# Altium project MPPT_charger.PrjPcb
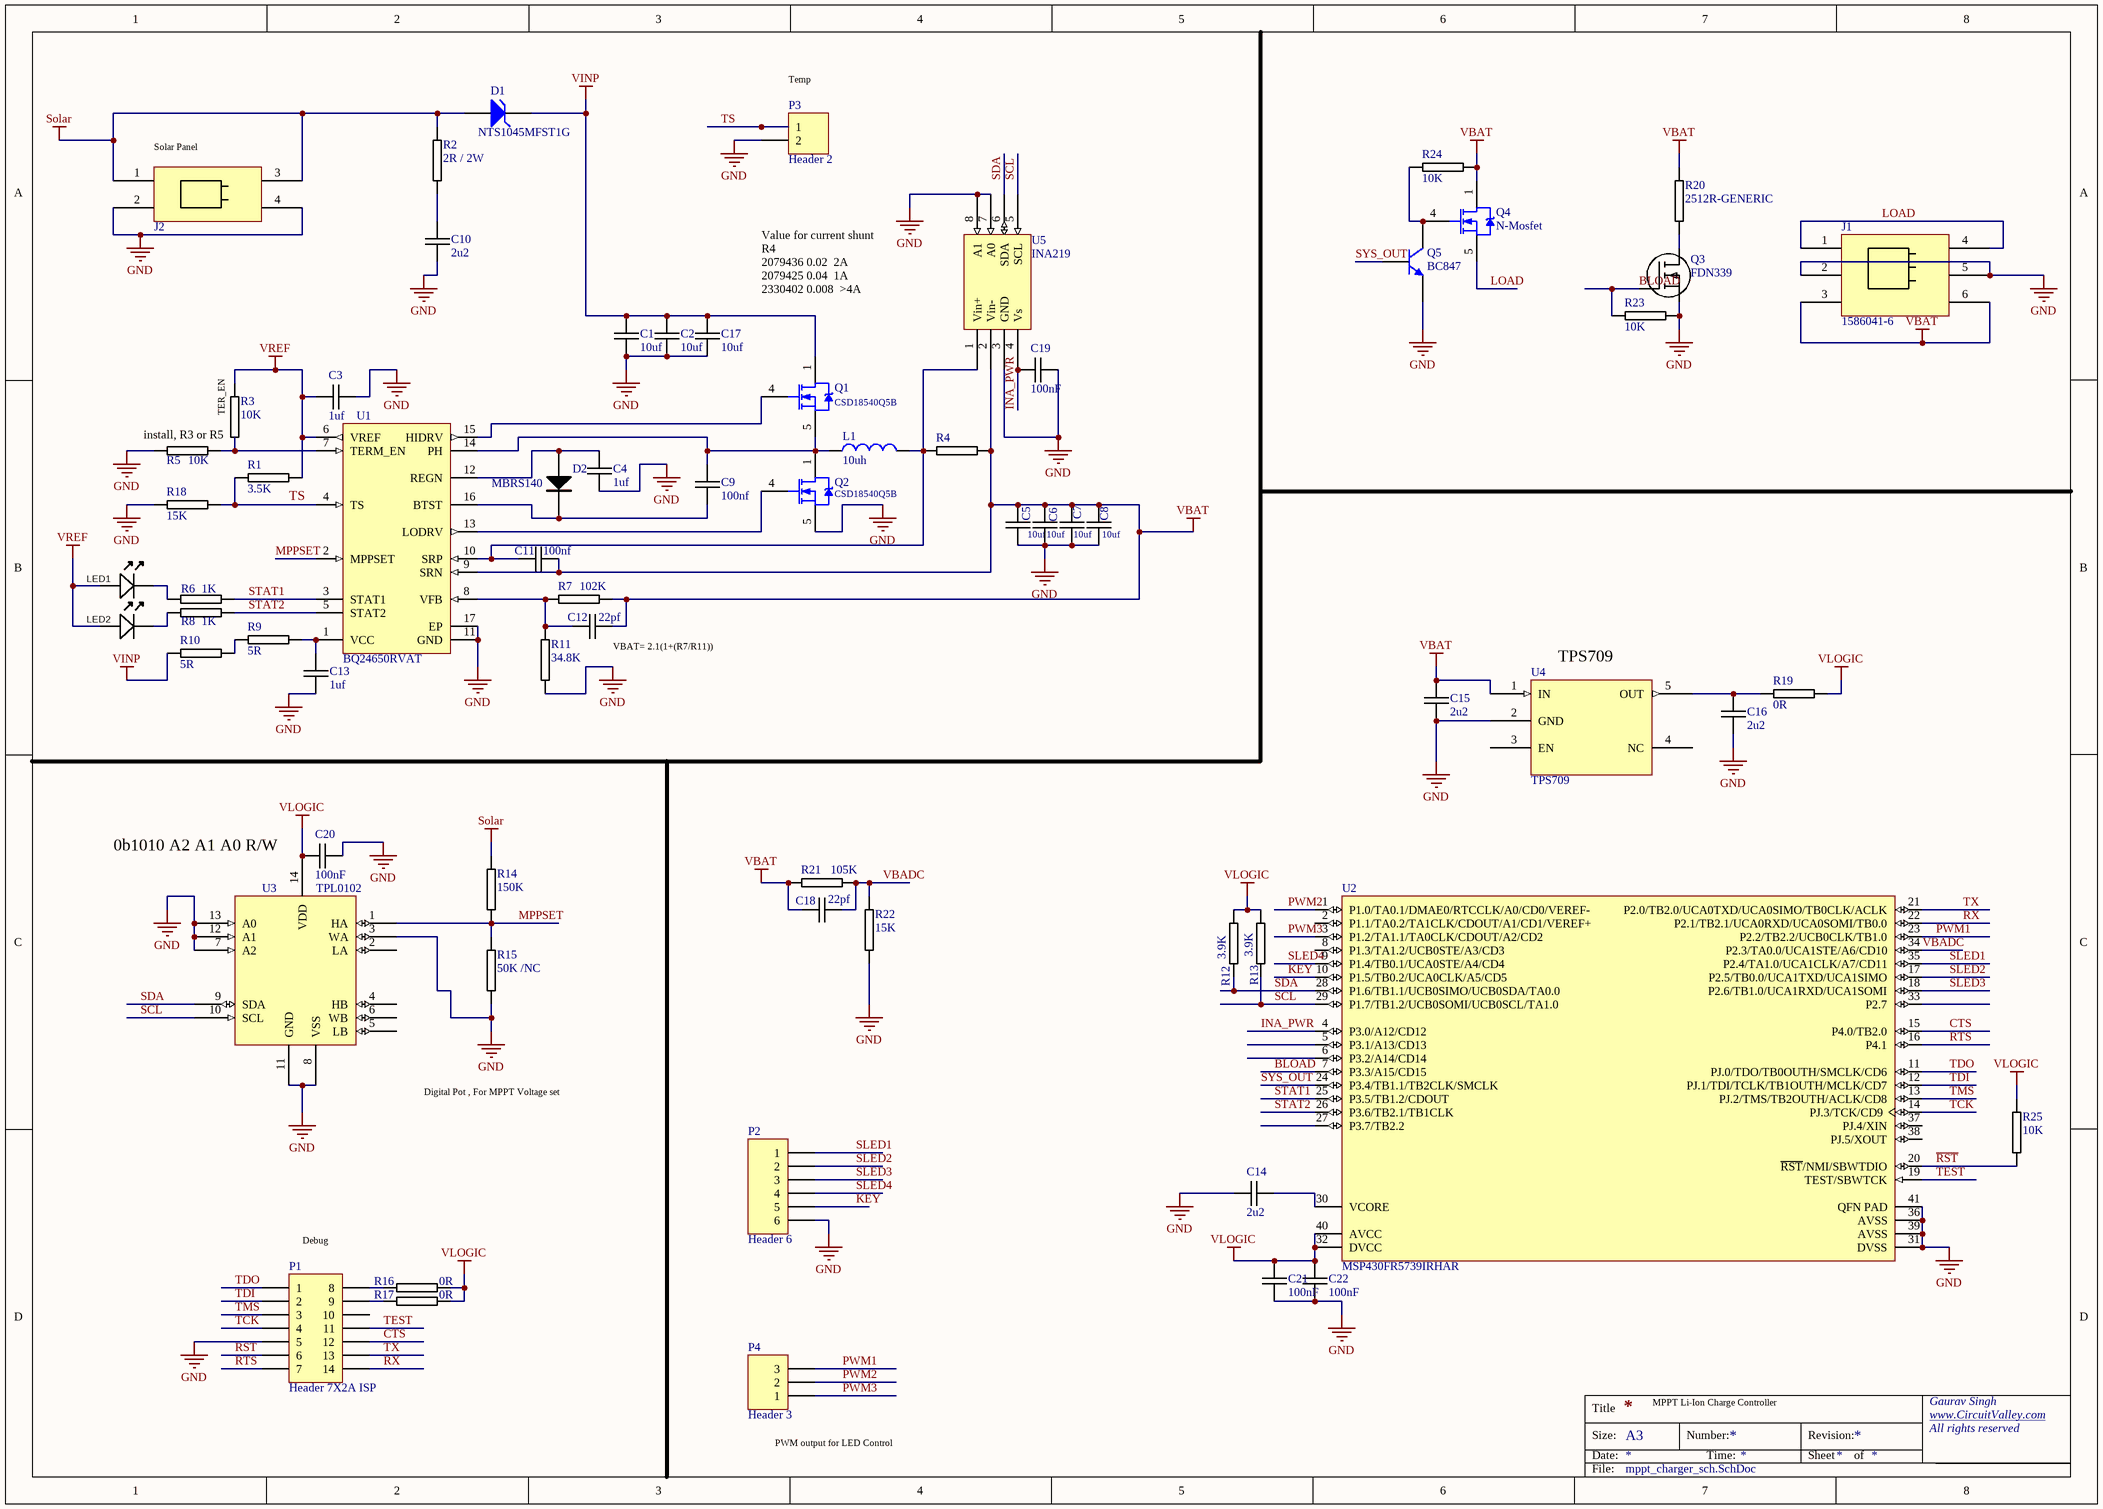
[diagram p0: mppt_charger_sch.SchDoc]
1 sheet, 68 parts. Net scope: global (net labels, ports and power ports of the same name join across sheets).
Board file: MPPT_charger.PcbDoc

## Sheet mppt_charger_sch.SchDoc
size A3

### Parts
C1  10uf  [1210C-GENERIC]
C2  10uf  [1210C-GENERIC]
C3  1uf  [0805C-GENERIC]
C4  1uf  [0805C-GENERIC]
C5  10uf  [1210C-GENERIC]
C6  10uf  [1210C-GENERIC]
C7  10uf  [1210C-GENERIC]
C8  10uf  [1210C-GENERIC]
C9  100nf  [0805C-GENERIC]
C10  2u2  [1210C-GENERIC]
C11  100nf  [0805C-GENERIC]
C12  22pf  [0805C-GENERIC]
C13  1uf  [0805C-TBD]
C14  2u2  [0805C-GENERIC]
C15  2u2  [1210C-GENERIC]
C16  2u2  [1210C-GENERIC]
C17  10uf  [1210C-GENERIC]
C18  22pf  [0805C-GENERIC]
C19  100nF  [0603C-GENERIC]
C20  100nF  [0603C-GENERIC]
C21  100nF  [0603C-GENERIC]
C22  100nF  [0603C-GENERIC]
D1  NTS1045MFST1G  [DFN5_5x6]
D2  MBRS140  [DIODE-SMA]
J1  1586041-6  [1586043-6]
J2  1586041-4  [1586043-4]  (value not drawn)
L1  10uh  [SRP1238A]
LED1  (no value)  [LED-0805-K]
LED2  (no value)  [LED-0805-K]
P1  Header 7X2A ISP  [HDR2X7_CEN]
P2  Header 6  [5267-06A]
P3  Header 2  [5267-02A]
P4  Header 3  [5267-03A]
Q1  CSD18540Q5B  [SON8]
Q2  CSD18540Q5B  [SON8]
Q3  FDN339  [SOT23-GDS]
Q4  N-Mosfet  [SON8]
Q5  BC847  [SOT23_N]
R1  3.5K  [0805R-2K2]
R2  2R / 2W  [2512R-GENERIC]
R3  10K  [0805R-2K2]
R4  (no value)  [2512R-GENERIC]
R5  10K  [0805R-2K2]
R6  1K  [0805R-2K2]
R7  102K  [0805R-2K2]
R8  1K  [0805R-2K2]
R9  5R  [0805R-2K2]
R10  5R  [0805R-2K2]
R11  34.8K  [0805R-2K2]
R12  3.9K  [0805R-2K2]
R13  3.9K  [0805R-2K2]
R14  150K  [0805R-2K2]
R15  50K /NC  [0805R-2K2]
R16  0R  [0805R-2K2]
R17  0R  [0805R-2K2]
R18  15K  [0805R-2K2]
R19  0R  [0805R-2K2]
R20  2512R-GENERIC  [2512R-GENERIC]
R21  105K  [0805R-2K2]
R22  15K  [0805R-2K2]
R23  10K  [0603R-10K]
R24  10K  [0603R-10K]
R25  10K  [0603R-10K]
U1  BQ24650RVAT  [QFN16]
U2  MSP430FR5739IRHAR  [QFN40]
U3  TPL0102  [XQFN14_2mmx2mm]
U4  TPS709  [SOT23-5]
U5  INA219  [SOT23-8]

### Nets
GND: C1.2 C2.2 C3.2 C4.2 C5.2 C6.2 C7.2 C8.2 C10.2 C13.2 C14.1 C15.2 C16.2 C17.2 C19.1 C20.2 C21.2 C22.2 J1.2(IN) J1.5 J2.2(IN) J2.4(IN) P1.5 P2.6 P3.2 Q2.5(S) Q3.S Q5.2(E) R5.1 R11.1 R15.1 R18.2 R22.1 R23.1 U1.11(GND) U1.17(EP) U2.31(DVSS) U2.36(AVSS) U2.39(AVSS) U2.41(QFN_PAD) U3.3(WA) U3.7(A2) U3.8(VSS) U3.11(GND) U3.12(A1) U3.13(A0) U4.2(GND) U5.3(GND) U5.7(A0) U5.8(A1)
Solar: D1.1(A) J2.1(IN) J2.3(IN) R2.2 R14.2
VBAT: C5.1 C6.1 C7.1 C8.1 C11.2 C12.2 C15.1 C18.2 J1.3(IN) J1.6 Q4.1(D) R4.2 R7.1 R20.2 R21.1 R24.1 U1.9(SRN) U4.1(IN) U5.2(Vin-)
VINP: C1.1 C2.1 C17.1 D1.2(K) Q1.1(D) R10.1
VLOGIC: C20.1 C21.1 C22.1 R12.2 R13.2 R16.1 R17.1 R19.1 R25.1 U2.32(DVCC) U2.40(AVCC) U3.14(VDD)
VREF: C3.1 LED1.A LED2.A R1.1 R3.2 U1.6(VREF)
BLOAD: Q3.G R23.2 U2.7(P3.3/A15/CD15)
CTS: P1.12 U2.15(P4.0/TB2.0)
INA_PWR: C19.2 U2.4(P3.0/A12/CD12) U5.4(Vs)
KEY: P2.5 U2.10(P1.5/TB0.2/UCA0CLK/A5/CD5)
LOAD: J1.1(IN) J1.4(IN) Q4.5(S)
MPPSET: R14.1 R15.2 U1.2(MPPSET) U3.1(HA)
PWM1: P4.3 U2.23(P2.2/TB2.2/UCB0CLK/TB1.0)
PWM2: P4.2 U2.1(P1.0/TA0.1/DMAE0/RTCCLK/A0/CD0/VEREF-)
PWM3: P4.1 U2.3(P1.2/TA1.1/TA0CLK/CDOUT/A2/CD2)
~{RST}: P1.6 R25.2 U2.20(~{RST}/NMI/SBWTDIO)
RTS: P1.7 U2.16(P4.1)
RX: P1.14 U2.22(P2.1/TB2.1/UCA0RXD/UCA0SOMI/TB0.0)
SCL: R13.1 U2.29(P1.7/TB1.2/UCB0SOMI/UCB0SCL/TA1.0) U3.10(SCL) U5.5(SCL)
SDA: R12.1 U2.28(P1.6/TB1.1/UCB0SIMO/UCB0SDA/TA0.0) U3.9(SDA) U5.6(SDA)
SLED1: P2.1 U2.35(P2.4/TA1.0/UCA1CLK/A7/CD11)
SLED2: P2.2 U2.17(P2.5/TB0.0/UCA1TXD/UCA1SIMO)
SLED3: P2.3 U2.18(P2.6/TB1.0/UCA1RXD/UCA1SOMI)
SLED4: P2.4 U2.9(P1.4/TB0.1/UCA0STE/A4/CD4)
STAT1: R6.2 U1.3(STAT1) U2.25(P3.5/TB1.2/CDOUT)
STAT2: R8.2 U1.5(STAT2) U2.26(P3.6/TB2.1/TB1CLK)
SYS_OUT: Q5.1(B) U2.24(P3.4/TB1.1/TB2CLK/SMCLK)
TCK: P1.4 U2.14(PJ.3/TCK/CD9)
TDI: P1.2 U2.12(PJ.1/TDI/TCLK/TB1OUTH/MCLK/CD7)
TDO: P1.1 U2.11(PJ.0/TDO/TB0OUTH/SMCLK/CD6)
TEST: P1.11 U2.19(TEST/SBWTCK)
TMS: P1.3 U2.13(PJ.2/TMS/TB2OUTH/ACLK/CD8)
TS: P3.1 R1.2 R18.1 U1.4(TS)
TX: P1.13 U2.21(P2.0/TB2.0/UCA0TXD/UCA0SIMO/TB0CLK/ACLK)
VBADC: C18.1 R21.2 R22.2 U2.34(P2.3/TA0.0/UCA1STE/A6/CD10)
NetC4_1: C4.1 D2.A U1.12(REGN)
NetC9_1: C9.1 L1.1 Q1.5(S) Q2.1(D) U1.14(PH)
NetC9_2: C9.2 D2.K U1.16(BTST)
NetC10_1: C10.1 R2.1
NetC11_1: C11.1 L1.2 R4.1 U1.10(SRP) U5.1(Vin+)
NetC12_1: C12.1 R7.2 R11.2 U1.8(VFB)
NetC13_1: C13.1 R9.2 U1.1(VCC)
NetC14_2: C14.2 U2.30(VCORE)
NetC16_1: C16.1 R19.2 U4.5(OUT)
NetLED1_K: LED1.K R6.1
NetLED2_K: LED2.K R8.1
NetP1_8: P1.8 R16.2
NetP1_9: P1.9 R17.2
NetQ1_4: Q1.4(G) U1.15(HIDRV)
NetQ2_4: Q2.4(G) U1.13(LODRV)
NetQ3_D: Q3.D R20.1
NetQ4_4: Q4.4(G) Q5.3(C) R24.2
NetR3_1: R3.1 R5.2 U1.7(TERM_EN)
NetR9_1: R9.1 R10.2

Not connected (* = marked no-connect by the designer): P1 10; U2 2(P1.1/TA0.2/TA1CLK/CDOUT/A1/CD1/VEREF+) 5(P3.1/A13/CD13) 6(P3.2/A14/CD14) 8(P1.3/TA1.2/UCB0STE/A3/CD3) 27(P3.7/TB2.2) 33(P2.7) 37(PJ.4/XIN) 38(PJ.5/XOUT); U3 2(LA) 4(HB) 5(LB) 6(WB); U4 3(EN) 4(NC)

### Notes on the sheet
- (near P3) Temp
- (near J2) Solar Panel
- Value for current shunt R4
  2079436 0.02  2A
  2079425 0.04  1A
  2330402 0.008  >4A
- (near R3) install, R3 or R5
- (near R3) TER_EN
- (near C12) VBAT= 2.1(1+(R7/R11))
- (near U4) TPS709
- 0b1010 A2 A1 A0 R/W
- Digital Pot , For MPPT Voltage set
- (near P1) Debug
- (near P4) PWM output for LED Control
- MPPT Li-Ion Charge Controller
- Title
- Size:
- Date:
- A3
- Number:
- Time:
- Revision:
- Sheet
- of
- Gaurav Singh
- www.CircuitValley.com
- All rights reserved
- File:

### Library data of the parts
C1 C2 C5-C8 C10 C15-C17 = 1210C-2u2-35V: GENERIC CAPACITOR NON POLARISED 1210; Manufacturer: Panasonic - ECG; Manufacturer Part Number: ECJ-4YB0J226M; Reel: C25; Supplier 1: Digi-Key; Supplier Part Number 1: 587-2255-2-ND
C3 C4 C9 C11 C12 C14 C18 = 0805C-2U2-6V3-X5R-PAN: CAPACITOR 0805 CERAMIC; Manufacturer Part Number: ECJ-1VB0J225K; Manufacturer: Panasonic - ECG; Reel: C7; Supplier 1: Digi-Key; Supplier Part Number 1: PCC2273TR-ND
C13 = 0805C-TBD: CAPACITOR 0805 CERAMIC VALUE TO BE DETERMINED
C19-C22 = 0603C-100NF-25V-X7R-TDK: CAPACITOR 0603 CERAMIC; Manufacturer Part Number: C1608X7R1E104K; Manufacturer: TDK Corporation; Reel: C12; Supplier 1: Digi-Key; Supplier Part Number 1: 445-1316-2-ND
D1 = SK3200: ELEMENT14 Order code: 2452050
D2 = MBRS140: DIODE; Supplier 1: Digi-Key; Supplier Part Number 1: MBRS140FSTR-ND
L1 = inductor_smd: ELEMENT14 Order code: 2434037
LED1 LED2 = LED_SMD_Green_0805: LED, 0805 SMD, Green; Manufacturer 1: Ligitek; Manufacturer Part Number 1: LG170G-CT; Material: GaP; Ratings: 10 mcd; 573 nm; Package / Case: 0805
P1 = Header 7X2A: Header, 7-Pin, Dual row; LatestRevisionDate: 17-Jul-2002; LatestRevisionNote: Re-released for DXP Platform.; Publisher: Altium Limited
P2 = Header 6: Header, 6-Pin; LatestRevisionDate: 17-Jul-2002; LatestRevisionNote: Re-released for DXP Platform.; Publisher: Altium Limited
P3 = Header 2: Header, 2-Pin; LatestRevisionDate: 17-Jul-2002; LatestRevisionNote: Re-released for DXP Platform.; Publisher: Altium Limited
P4 = Header 3: Header, 3-Pin; LatestRevisionDate: 17-Jul-2002; LatestRevisionNote: Re-released for DXP Platform.; Publisher: Altium Limited
Q1 Q2 = N-Mosfet
Q3 = FDN339: N-MOS TRANSISTOR FDN339; Manufacturer: Fairchild Semiconductor; Manufacturer Part Number: FDN339AN; Power - Max: 460mW; Rds On (Max) @ Id, Vgs: 35 mOhm @ 3A, 4.5V; FET Type: MOSFET N-Channel, Metal Oxide; Vgs(th) (Max) @ Id: 1.5V @ 250µA; FET Feature: Logic Level Gate; Input Capacitance (Ciss) @ Vds: 700pF @ 10V; Current - Continuous Drain (Id) @ 25° C: 3A; Drain to Source Voltage (Vdss): 20V; Gate Charge (Qg) @ Vgs: 10nC @ 4.5V; Reel: Q4; Supplier 1: Digi-Key; Supplier Part Number 1: FDN339ANTR-ND; Mounting Type: Surface Mount; RoHS: RoHS Compliant; Packaging: Tape & Reel (TR); Supplier: Digi-Key; Supplier Part Number: FDN339ANTR-ND; Package / Case: 3-SSOT, SuperSOT-3; Category: Discrete Semiconductor Products
Q5 = BC847: NPN General-purpose Transistor; Published: 17-Sep-2003; LatestRevisionDate: 12-Dec-2006; LatestRevisionNote: IPC-7351 Footprint Added.; DatasheetVersion: 4-Feb-2002; PackageVersion: May-1999; PackageReference: SOT23; Publisher: Altium Limited; PackageDescription: 3-Pin SOT-23 Package 0.95 mm Pitch, 2.3 mm Lead Span; ComponentLink1Description: Manufacturer Link; ComponentLink1URL: http://www.semiconductors.philips.com/; ComponentLink2Description: Datasheet; ComponentLink2URL: http://www.semiconductors.philips.com/acrobat/datasheets/BC846_BC847_BC848_5.pdf
R1 R3 R5-R19 R21 R22 = 0805R-2K2: RESISTOR 0805 1/4 WATT THIN FILM; Reel: *
R2 R4 R20 = 2512R-GENERIC: GENERIC RESISTOR 2512; Reel: *
  R2: ELEMENT14 Order code: 2328162
R23-R25 = 0603R-10K: GENERIC RESISTOR 0603; Manufacturer: Stackpole Electronics Inc; Manufacturer Part Number: RMCF 1/16 10K 1% R; Tolerance: ±1%; Power (Watts): 0.1W, 1/10W; Temperature Coefficient: ±100ppm/°C; Resistance In Ohms: 10.0K; Reel: R21; Category: Resistors; Supplier Part Number: RMCF1/1610KFRDKR-ND; Lead Style: Surface Mount (SMD - SMT); RoHS: RoHS Compliant; Packaging: Digi-Reel®; Case: 0603 (1608 metric); Composition: Thick Film; Supplier: Digi-Key; Supplier 1: Digi-Key; Supplier Part Number 1: RMCF0603FT10K0DKR-ND
U1 = BQ24650RVAT: High Efficiency Synchronous Switch-Mode Charger Controller- Solar Battery Charger, 5 V, -40 to 85 degC, 16-pin VQFN (RVA), Green (RoHS & no Sb/Br); Manufacturer: Texas Instruments; Lead Acid: N; SubFamily: Battery Charge Management; Vin(Min)(V): 5; DatasheetVersion: SLUSA75; PackageVersion: revC, May-2011; PackageReference: RVA16-2140X2140TP; PackageDescription: 16-Pin Plastic Quad Flatpack No-Lead, 3.5 x 3.5 mm Body, 0.5 mm Pitch, Exposed Pad; Supplier 1: Digi-Key; Supplier Part Number 1: 296-27699-2-ND; Supplier 2: Digi-Key; Supplier Part Number 2: 296-27699-1-ND; Supplier 3: Digi-Key; Supplier Part Number 3: 296-27699-6-ND; Supplier 4: Farnell; Supplier Part Number 4: 1882266RL; Supplier 5: Farnell; Supplier Part Number 5: 1882266; Supplier 6: Farnell; Supplier Part Number 6: 2125812; Supplier 7: Newark; Supplier Part Number 7: 83R9416; Supplier 8: Mouser; Supplier Part Number 8: 595-BQ24650RVAT; Eco-Plan: Green (RoHS & no Sb/Br); Li-Ion: N; Li-Polymer: N; NiCd: N; NiMH: N; Over Voltage Protection: N; Mounting Technology: Surface Mount; PartNumber: BQ24650RVAT; ComponentLink1Description: Datasheet; ComponentLink1URL: http://www.ti.com/general/docs/lit/getliterature.tsp?genericPartNumber=BQ24650&fileType=pdf
U2 = MSP430FR5739IRHAR: 24 MHz Mixed Signal Microcontroller, 1024 B SRAM and 33 GPIOs, -40 to 85 degC, 40-pin QFN (RHA), Green (RoHS & no Sb/Br); Manufacturer: Texas Instruments; ADC: 10-bit SAR; ADC Channels: 14; Brown Out Reset: Yes; DMA: 3; FRAM(KB): 16; Frequency(MHz): 24; GPIO: 33; Multiplier: 32x32; SRAM(B): 1024; SubFamily: FRAM Series; Timers - 16-bit: 5; USCI_A (UART/LIN/IrDA/SPI): 2; USCI_B (I2C & SPI): 1; DatasheetVersion: SLAS639D; PackageReference: RHA40-2900X2900TP; PackageDescription: 40-Pin Plastic Flat Pack, Body 6 x 6 mm, Pitch 0.5 mm; Supplier 1: Digi-Key; Supplier Part Number 1: 296-29235-2-ND; Supplier 2: Digi-Key; Supplier Part Number 2: 296-29235-1-ND; Supplier 3: Digi-Key; Supplier Part Number 3: 296-29235-6-ND; Supplier 4: Newark; Supplier Part Number 4: 45T9762; Supplier 5: Mouser; Supplier Part Number 5: 595-MSP430FR5739IDAR; Comparators: Yes; Eco-Plan: Green (RoHS & no Sb/Br); Real-Time Clock: Yes; SVS: Yes; Watchdog: Yes; Mounting Technology: Surface Mount; Code_JEDEC: MO-153; PartNumber: MSP430FR5739IRHAR; ComponentLink1Description: Manufacturer URL; ComponentLink1URL: http://www.ti.com/; ComponentLink2Description: Datasheet; ComponentLink2URL: http://www.ti.com/general/docs/lit/getliterature.tsp?genericPartNumber=MSP430FR5739&fileType=pdf; ComponentLink3Description: Package Specification; ComponentLink3URL: http://www.ti.com/litv/pdf/mtss003d
U3 = TPL0102: Digital Pot 2 channel 256 setp nov volatile memeory